# Altium schematic sheet GATE_BOARD.SchDoc
size 420 x 297 mm; SPICEModelCacheYQEDCYZF: <root> / <DocumentId>YQEDCYZF</DocumentId> / </root>
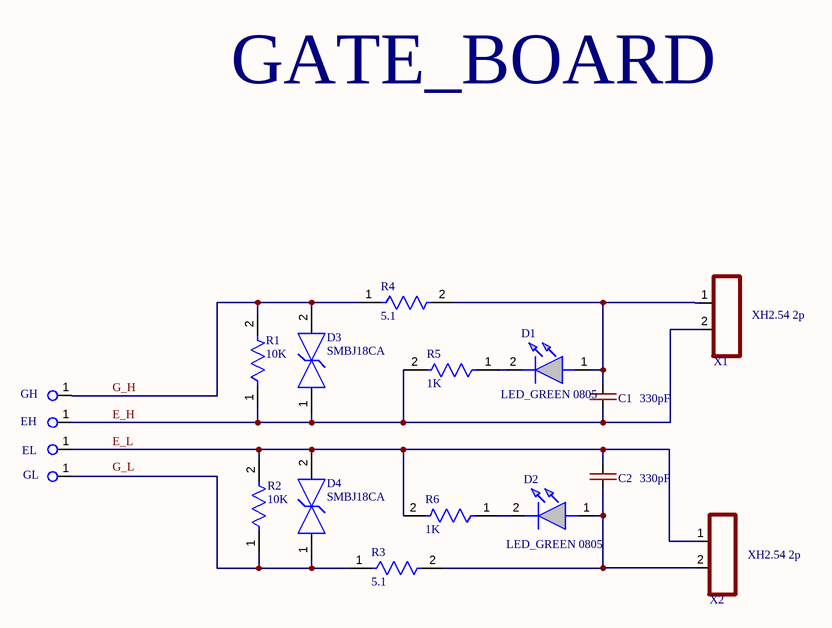
[diagram p0: GATE_BOARD.SchDoc]

## Parts
C1  330pF  [CAP-0805]
C2  330pF  [CAP-0805]
D1  LED_GREEN 0805  [LED_GREEN]
D2  LED_GREEN 0805  [LED_GREEN]
D3  SMBJ18CA  [FP-SMBJ-MFG]
D4  SMBJ18CA  [FP-SMBJ-MFG]
EH  Test_Point_PCB  [Conn_Pad]  (value not drawn)
EL  Test_Point_PCB  [Conn_Pad]  (value not drawn)
GL  Test_Point_PCB  [Conn_Pad]  (value not drawn)
R1  10K  [RES-1206]
R2  10K  [RES-1206]
R3  5.1  [RES-2512]
R4  5.1  [RES-2512]
R5  1K  [RES-0805]
R6  1K  [RES-0805]
TP4  GH  [Conn_Pad]
X1  XH2.54 2p  [CONN-PLS-2-2.54mm]
X2  XH2.54 2p  [CONN-PLS-2-2.54mm]

## Nets
E_H: C1.1 D3.1 EH.1(G9) R1.1 R5.2 X1.2
E_L: C2.2 D4.2 EL.1(G9) R2.2 R6.2 X2.1
G_H: D3.2 R1.2 R4.1 TP4.1(G9)
NetC1_2: C1.2 D1.1(A) R4.2 X1.1
NetC2_1: C2.1 D2.1(A) R3.2 X2.2
NetD1_2: D1.2(K) R5.1
NetD2_2: D2.2(K) R6.1
NetD4_1: D4.1 GL.1(G9) R2.1 R3.1

## Notes on the sheet
- GATE_BOARD
- Labels drawn without touching a wire or pin: G_L
- THIS DOCUMENT AND THE DATA DISCLOSED HEREIN OR
- HEREWITH IS THE PROPERTY OF ALTIUM LIMITED AND MAY
- DWG NO:
- REVISION
- REV:
- DESCRIPTION
- DATE
- APPROVED
- BE FREELY DISTRIBUTED IN WHOLE. NO RIGHTS ARE
- RESERVED OR EXPRESS OR IMPLIED WARANTEE GIVEN.
- ENG:
- APPROVALS
- PROJECT
- DSN:
- CHK:
- REFERENCE DOCUMENTS
- PROJECT REVISION:
- TITLE
- DOCUMENT REVISION:
- DESIGN ITEM:
- BOM:
- FAB DWG:
- PCB DWG:
- ASSY DWG:
- SCALE:
- A3
- SIZE
- CAGE CODE
- FILE NAME
- DWG NO.
- SHEET
- OF
- REV

## Library data of the parts
C1 C2 = CAP-NON-POLAR
D1 D2 = LED: Manufacturer_Name: Wurth Elektronik; Manufacturer_Part_Number: 151031YS06000; Geometry.Height: 5.5mm; Mouser Part Number: 710-151031YS06000; Mouser Price/Stock: https://www.mouser.co.uk/ProductDetail/Wurth-Elektronik/151031YS06000?qs=LlUlMxKIyB3xSYYW%252BcuBiQ%3D%3D; Arrow Part Number: *; Arrow Price/Stock: *; Mouser Testing Part Number: *; Mouser Testing Price/Stock: *; Datasheet Link: https://katalog.we-online.de/led/datasheet/151031YS06000.pdf
D3 D4 = CMP-08607-000021-1: TVS DIODE 18V 29.2V DO214AA; Manufacturer: Littelfuse Inc; Number Of Channels: 1; Peak Pulse Power: 600W; Max Junction Temp: +150°C; Peak Pulse Current: 20.6A; Direction: Bidirectional; Breakdown Voltage: 20V; RoHS: TRUE; Lead Free: Yes; Category: Diode; Clamping Voltage: 29.2V; Height: 2.61mm; Manufacturer Part Number: SMBJ18CA; Reverse Standoff Voltage: 18V; Device Class L3: unset; Device Class L2: TVS Diodes; Package: SMBJ; Digikey Description: TVS DIODE 18V 29.2V DO214AA; Device Class L1: Circuit Protection; ComponentLink2Description: Datasheet; ComponentLink2URL: https://www.littelfuse.com/~/media/electronics/datasheets/tvs_diodes/littelfuse_tvs_diode_smbj_datasheet.pdf.pdf; Temperature: -65°C to +150°C; Temperature Range High: +150°C; Mouser Description: SMBJ Series 29.2 V 0.6 kW Surface Mount Bi-Directional TVS Diode - DO-214AA; Automotive: No; Octopart: https://octopart.com/smbj18ca-littelfuse-350695; Temperature Range Low: -65°C
EH EL GL TP4 = TP_PCB?: Test_Point
R1-R6 = RES-CONST
X1 X2 = CONN-2-PIN